# Altium schematic sheet IMU.SchDoc
size A4
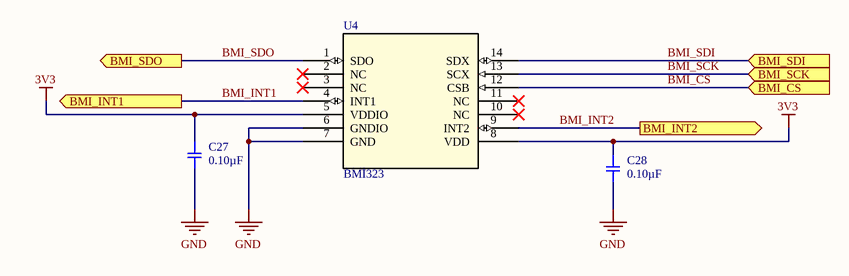
[diagram p0: IMU.SchDoc]

## Parts
C27  value 0.10µF  [SMD-0402C]  (hidden comment: GRM155R61A104KA01J)
C28  value 0.10µF  [SMD-0402C]  (hidden comment: GRM155R61A104KA01J)
U4  BMI323  [BMI323_BOS]

## Ports
BMI_CS (in), BMI_INT1 (out), BMI_INT2 (out), BMI_SCK (in), BMI_SDI (in), BMI_SDO (out)

## Nets
3V3: C27.1 C28.1 U4.5(VDDIO) U4.8(VDD)
GND: C27.2 C28.2 U4.6(GNDIO) U4.7(GND)
BMI_CS: U4.12(CSB) ; port BMI_CS
BMI_INT1: U4.4(INT1) ; port BMI_INT1
BMI_INT2: U4.9(INT2) ; port BMI_INT2
BMI_SCK: U4.13(SCX) ; port BMI_SCK
BMI_SDI: U4.14(SDX) ; port BMI_SDI
BMI_SDO: U4.1(SDO) ; port BMI_SDO

Not connected (* = marked no-connect by the designer): U4 2(NC)* 3(NC)* 10(NC)* 11(NC)*

## Library data of the parts
C27 C28 = CMP-140-000687-1: CAP CER 0.1UF 10V X5R 0402; Manufacturer: Murata Electronics North America; Factory Stock: 0; Unit Price (USD): 0.1; Minimum Quantity: 1; Tolerance: ±10%; Ratings: -; Lead Spacing: -; Source: capacitor_murata_0402$.SchLib; Part Status: Active; Pin Count: 2; Digi-Key Part Number: 490-6297-1-ND; Operating Temperature: -55°C ~ 85°C; Height - Seated (Max): -; Voltage: 10V; @ qty: 0; Temperature Coefficient: X5R; Package / Case: 0402 (1005 Metric); Size / Dimension: 0.039" L x 0.020" W (1.00mm x 0.50mm); Quantity Available: 24406; Datasheets: http://www.murata.com/~/media/webrenewal/support/library/catalog/products/capacitor/mlcc/c02e.pdf; Series: GRM; Applications: General Purpose; Thickness (Max): 0.022" (0.55mm); Image: //media.digikey.com/Renders/Murata%20Renders/ZRB-SERIES-0402.jpg; Packaging: Cut Tape (CT); Part Number: GRM155R61A104KA01J; Features: -; Component Type: Standard; Mounting Type: Surface Mount, MLCC; Design Item ID: GRM155R61A104KA01J
U4 = CMP-036-000000-1: Description; Manufacturer_Name: Bosch Sensortec; Design Item ID: BMI323; Pin Count: 14; RefDes: RefDes; Type: Type; Manufacturer_Part_Number: BMI323; Copyright: Copyright (C) 2025 Ultra Librarian. All rights reserved.; Source: BMI323.SchLib; Component Type: Standard